# Altium schematic sheet 3_Phase_Amp.SchDoc
size A4; DocumentNumber: 2; SheetNumber: 3; SheetTotal: 8
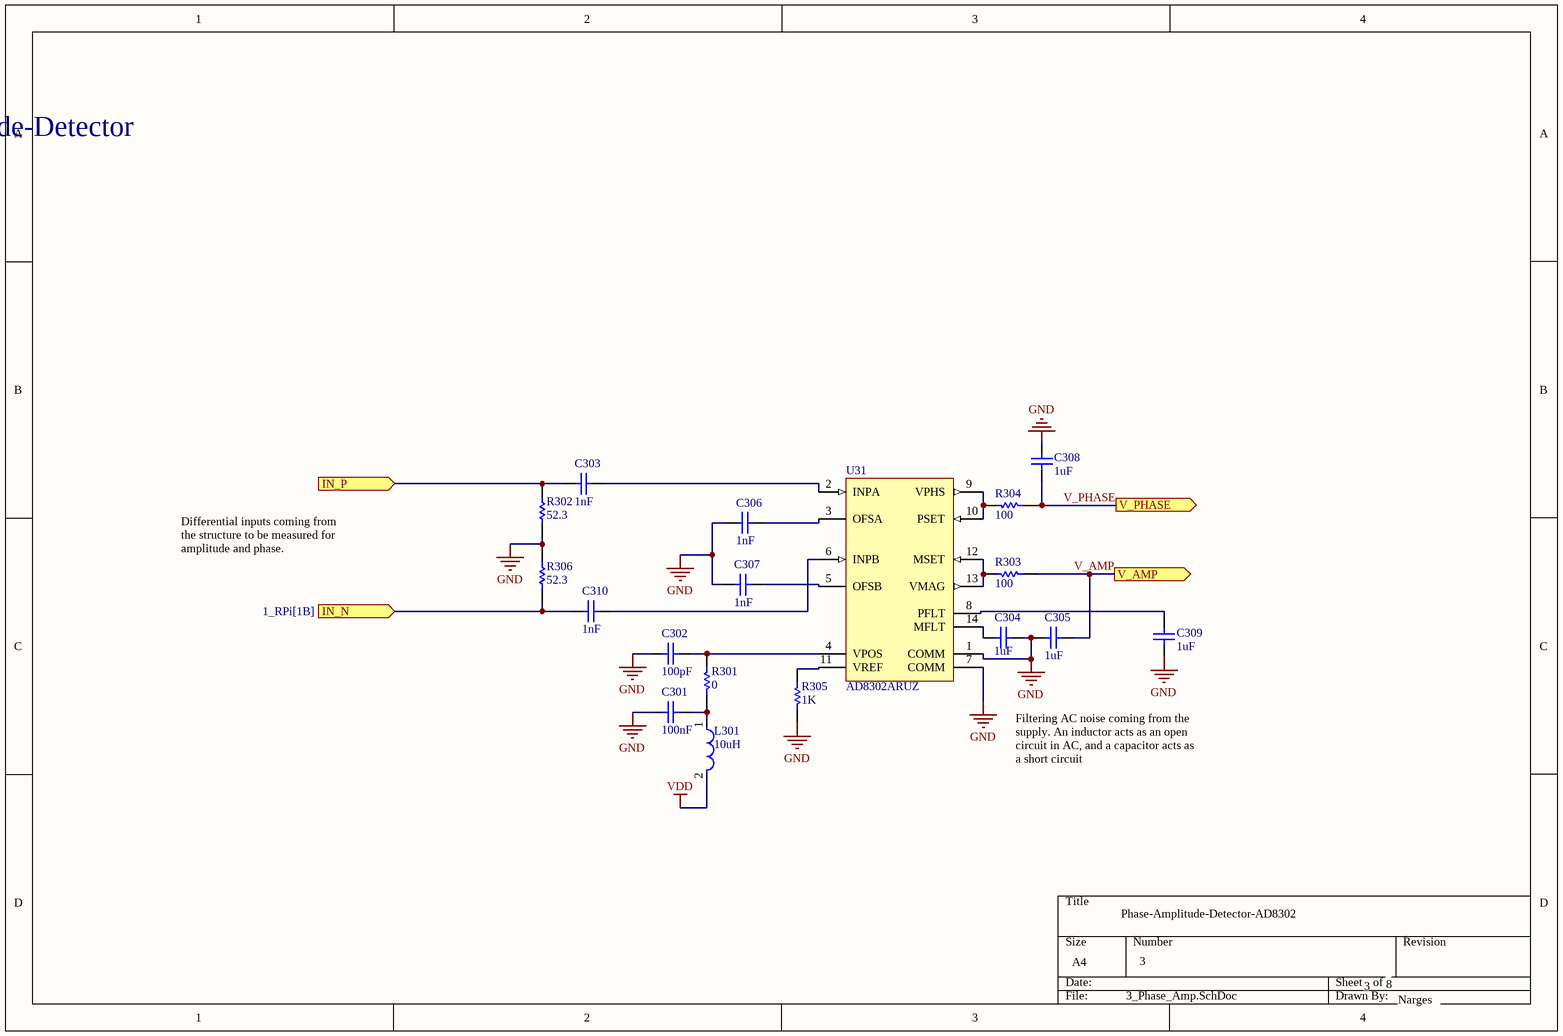
[diagram p0: 3_Phase_Amp.SchDoc]

## Parts
C301  value 100nF  [CAPC1005X55X30LL05T10]  (hidden comment: generic)
C302  value 100pF  [CAPC1005X55X30LL05T10]  (hidden comment: generic)
C303  value 1nF  [CAPC1005X55X30LL05T10]  (hidden comment: generic)
C304  value 1uF  [CAPC1005X55X30LL05T10]  (hidden comment: generic)
C305  value 1uF  [CAPC1005X55X30LL05T10]  (hidden comment: generic)
C306  value 1nF  [CAPC1005X55X30LL05T10]  (hidden comment: generic)
C307  value 1nF  [CAPC1005X55X30LL05T10]  (hidden comment: generic)
C308  value 1uF  [CAPC1005X55X30LL05T10]  (hidden comment: generic)
C309  value 1uF  [CAPC1005X55X30LL05T10]  (hidden comment: generic)
C310  value 1nF  [CAPC1005X55X30LL05T10]  (hidden comment: generic)
L301  Inductance: 10uH  [IND_0402HL-821XJRU]  (hidden comment: LQW18AN10NG00D)
R301  0  [RESC1005X40X25LL10T10]
R302  52.3  [RESC1005X40X25LL10T10]
R303  100  [RESC1005X40X25LL10T10]
R304  100  [RESC1005X40X25LL10T10]
R305  1K  [RESC1005X40X25LL10T10]
R306  52.3  [RESC1005X40X25LL10T10]
U31  AD8302ARUZ  [ADI-RU-14_L]

## Ports
IN_N (in, see 1_RPi[1B]), IN_P (in, see 1_RPi[1B]), V_AMP (out, see 1_RPi[1A]), V_PHASE (out, see 1_RPi[1A])

## Nets
GND: C301.1 C302.1 C304.1 C305.1 C306.2 C307.2 C308.1 C309.1 R302.1 R305.1 R306.2 U31.1(COMM) U31.7(COMM)
VDD: L301.2
IN_N: C310.2 R306.1 ; port IN_N
IN_P: C303.1 R302.2 ; port IN_P
V_AMP: C305.2 R303.2 ; port V_AMP
V_PHASE: C308.2 R304.2 ; port V_PHASE
NetC301_2: C301.2 L301.1 R301.2
NetC302_2: C302.2 R301.1 U31.4(VPOS)
NetC303_2: C303.2 U31.2(INPA)
NetC304_2: C304.2 U31.14(MFLT)
NetC306_1: C306.1 U31.3(OFSA)
NetC307_1: C307.1 U31.5(OFSB)
NetC309_2: C309.2 U31.8(PFLT)
NetC310_1: C310.1 U31.6(INPB)
NetR303_1: R303.1 U31.12(MSET) U31.13(VMAG)
NetR304_1: R304.1 U31.9(VPHS) U31.10(PSET)
NetR305_2: R305.2 U31.11(VREF)

## Notes on the sheet
- [3] - 3_EIT_Phase-Amplitude-Detector
- Differential inputs coming from the structure to be measured for amplitude and phase.
- Filtering AC noise coming from the supply. An inductor acts as an open circuit in AC, and a capacitor acts as a short circuit
- Phase-Amplitude-Detector-AD8302
- 3
- 8
- Narges

## Library data of the parts
C301-C310 = Capacitor: Device Class L1: Passive Components; Device Class L2: Capacitors
L301 = 725321dda6339637d4d059423bc1c3c: Wire Wound RF Inductor 10nH ±2% 650mA 0.11Ω 0603 (1608); DC Resistance (DCR): 110mR; Q Factor: 35; Shielding: Unshielded; Test Frequency: 100MHz; Current: 550mA; Self Resonant Frequency: 6GHz; Radiation Hardening: No; Depth: 1mm; Case Code (Imperial): 0603; Inductance Tolerance: 2%; Series: LQW18A_00; Tolerance: 2%; Weight: 0.000106oz; Rated Current-Max: 650mA; Mount: Surface Mount; Series Resistance: 110mR; REACH SVHC: No SVHC; Current Rating: 650mA; Case Code (Metric): 1608; Lead Free: Lead Free; Resistor Type: Wirewound; Package Quantity: 4000; Termination: SMD/SMT; DC Current: 650mA; Height: 0.8mm; Min Operating Temperature: -55°C; Military Standard: Not; Max Operating Temperature: 125°C; Max DC Current: 650mA; Case/Package: 0603; Number of Pins: 2; Packaging: Tape and Reel; Width: 0.8mm; Length: 1.6mm
R301-R306 = Resistor: generic; Part Number: RC0402FR-0747KL; Manufacturer: Yageo / Phycomp
U31 = CMP-0284-00076-1: LF-2.7 GHz RF/IF Gain and Phase Detector, 60ns Response Time, RU-14, Pb-Free, 96 Tube; Voltage Supply (V): 2.7 to 5.5; RF Frequency (MHz): 2700; Dynamic Range (dB): 60dB; Supply Current: 19mA; Temp Stability (dB): 1dB; Product Description: Dual-Channel Gain and Phase Outputs; ComponentLink1URL: www.analog.com; Response Time (ns typ): 60ns; ComponentLink1Description: Manufacturer URL; Code_JEDEC: MO-153AB-1; ComponentLink3URL: http://www.analog.com/static/imported-files/packages/36057385283879153717235186773RU14.pdf; PackageReference: RU-14; PackageVersion: Aug-2002; DatasheetVersion: Rev. A; ComponentLink2URL: http://www.analog.com/static/imported-files/data_sheets/AD8302.pdf; ComponentLink3Description: Package Specification; PackageDescription: 14-Lead Thin Shrink Small Outline Package [TSSOP]; ComponentLink2Description: Datasheet